# EAGLE schematic ArduinoShield (EAGLE 5.10)
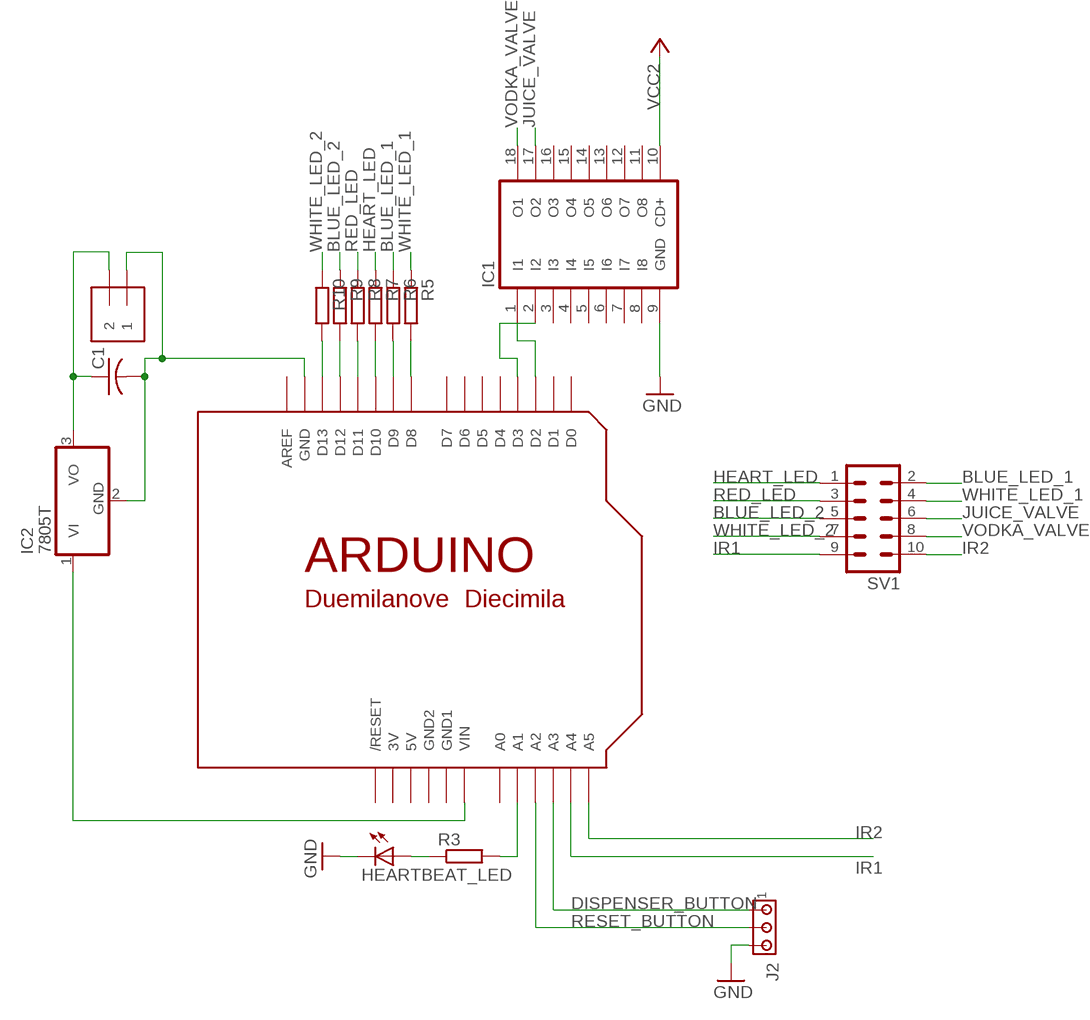
[diagram p0: schematic, sheet 1]

## Parts
C1  C-US050-024X044  [C050-024X044]
HEARTBEAT_LED  LED5MM  [LED5MM]
IC1  ULN2803A  [DIL18]
IC2  7805T  [TO220H]
J1  1X2-3.5MM  [1X2-3.5MM]
J2  MTA03-156  [1X3MTA]
R3  R-EU_0207/10  [0207/10]
R5  R-EU_0207/10  [0207/10]
R6  R-EU_0207/10  [0207/10]
R7  R-EU_0207/10  [0207/10]
R8  R-EU_0207/10  [0207/10]
R9  R-EU_0207/10  [0207/10]
R10  R-EU_0207/10  [0207/10]
SV1  ML10  [ML10]
U$1  ARDUINOUNO  [ARDUINO]

## Nets
BLUE_LED_1: R6.1 SV1.2
BLUE_LED_2: R9.1 SV1.5
DISPENSER_BUTTON: J2.1 U$1.A3
GND: C1.2 HEARTBEAT_LED.K(C) IC1.9(GND) IC2.2(GND) J1.1 J2.3 U$1.GND
HEART_LED: R7.1 SV1.1
IR1: SV1.9 U$1.A4
IR2: SV1.10 U$1.A5
JUICE_VALVE: IC1.17(O2) SV1.6
N$3: R10.2 U$1.D13
N$4: R9.2 U$1.D12
N$5: R8.2 U$1.D11
N$6: R7.2 U$1.D10
N$7: R6.2 U$1.D9
N$8: R5.2 U$1.D8
N$10: IC1.1(I1) U$1.D2
N$11: IC1.2(I2) U$1.D3
N$20: HEARTBEAT_LED.A R3.1
N$21: R3.2 U$1.A1
RED_LED: R8.1 SV1.3
RESET_BUTTON: J2.2 U$1.A2
VCC2: C1.1 IC1.10(CD+) IC2.3(VO) J1.2 ; supply symbol labelled VCC
VIN: IC2.1(VI) U$1.VIN
VODKA_VALVE: IC1.18(O1) SV1.8
WHITE_LED_1: R5.1 SV1.4
WHITE_LED_2: R10.1 SV1.7
Unconnected: IC1.3(I3) IC1.4(I4) IC1.5(I5) IC1.6(I6) IC1.7(I7) IC1.8(I8) IC1.11(O8) IC1.12(O7) IC1.13(O6) IC1.14(O5) IC1.15(O4) IC1.16(O3) U$1.A0 U$1.AREF U$1.D0 U$1.D1 U$1.D4 U$1.D5 U$1.D6 U$1.D7 U$1.RESET(/RESET)

## Power pins joined to a net without a drawn wire
3V: U$1.3V
5V: U$1.5V
GND1: U$1.GND1
GND2: U$1.GND2

## Library data of the parts
C1 = rcl:C-US: CAPACITOR, American symbol
HEARTBEAT_LED = adafruit:LED: LED OSRAM: - CHIPLED LG R971, LG N971, LY N971, LG Q971, LY Q971, LO R971, LY R971 LH N974, LH R974 LS Q976, LO Q976, LY Q976 LO Q996 - Hyper CHIPLED LW Q18S LB Q993, LB Q99A, LB R99A - SideLED LS A670, LO A670, LY A670, LG A670, LP A670 LB A673, LV A673, LT A673, LW A673 LH A674 LY A675 LS A676, LA A676, LO A676, LY A676, LW A676 LS A679, LY A679, LG A679 - Hyper Micro SIDELED® LS Y876, LA Y876, LO Y876, LY Y876 LT Y87S - SmartLED LW L88C, LW L88S LB L89C, LB L89S, LG L890 LS L89K, LO L89K, LY L89K LS L896, LA L896, LO L896, LY L896 - TOPLED LS T670, LO T670, LY T670, LG T670, LP T670 LSG T670, LSP T670, LSY T670, LOP T670, LYG T670 LG T671, LOG T671, LSG T671 LB T673, LV T673, LT T673, LW T673 LH T674 LS T676, LA T676, LO T676, LY T676, LB T676, LH T676, LSB T676, LW T676 LB T67C, LV T67C, LT T67C, LS T67K, LO T67K, LY T67K, LW E67C LS E67B, LA E67B, LO E67B, LY E67B, LB E67C, LV E67C, LT E67C LW T67C LS T679, LY T679, LG T679 LS T770, LO T770, LY T770, LG T770, LP T770 LB T773, LV T773, LT T773, LW T773 LH T774 LS E675, LA E675, LY E675, LS T675 LS T776, LA T776, LO T776, LY T776, LB T776 LHGB T686 LT T68C, LB T68C - Hyper Mini TOPLED® LB M676 - Mini TOPLED Santana® LG M470 LS M47K, LO M47K, LY M47K Source: http://www.osram.convergy.de/
IC1 = uln-udn:ULN2803A: DRIVER ARRAY
IC2 = adafruit:78*: Positive VOLTAGE REGULATOR Added bigger pads to the TO-92 package
J1 = adafruit:1X2: 3.5mm Terminal block http://www.ladyada.net/library/pcb/eaglelibrary.html
J2 = con-amp:MTA03-156: AMP connector
R3 R5-R10 = rcl:R-EU_: RESISTOR, European symbol
SV1 = con-harting-ml:ML10: HARTING
U$1 = adafruit:ARDUINO: Arduino Diecimila/Duemilanove Make a shield with ease, this package has all the named pins as well as the two mounting drill holes and an outline of the USB and DC power connector. The outline is on the DIMENSION layer, so if your board house uses it they will cut the outline to match. http://www.ladyada.net/library/pcb/eaglelibrary.html